# Altium schematic sheet SWITCHING.SchDoc
size 420 x 297 mm; SheetNumber: 6; SheetTotal: 6
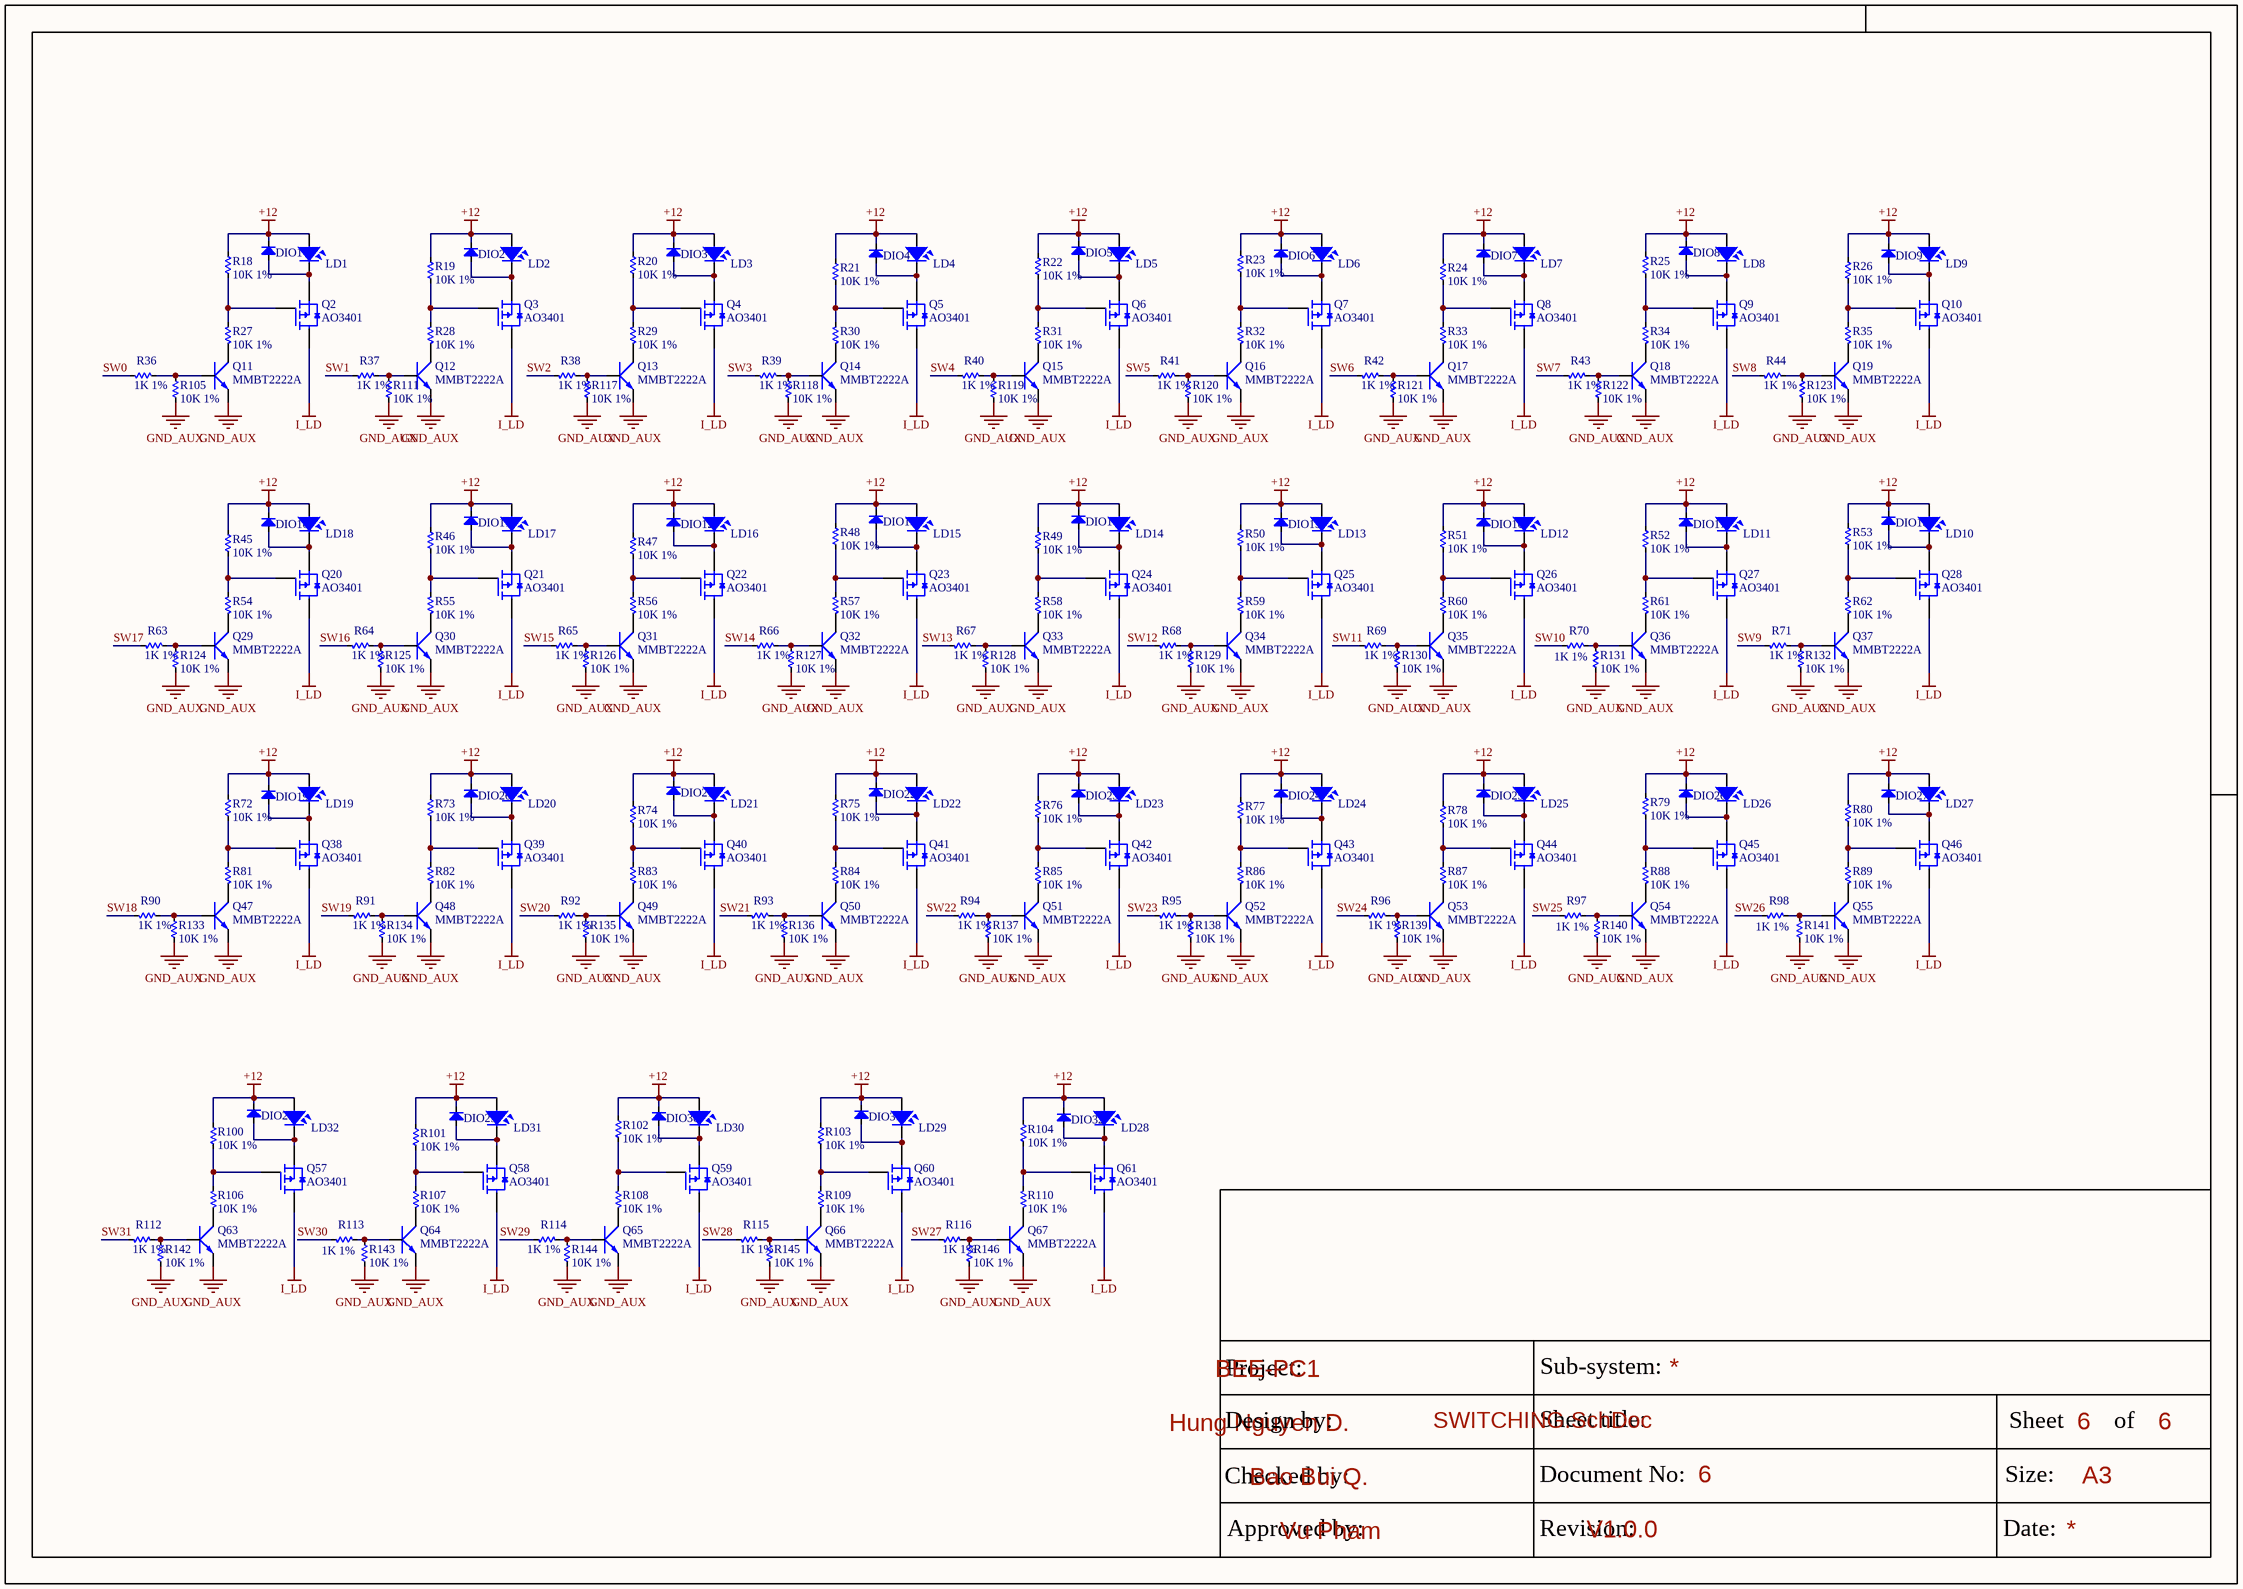
[diagram p0: SWITCHING.SchDoc]

## Parts
DIO1  Diode SMD  [SOD23]  (value not drawn)
DIO2  Diode SMD  [SOD23]  (value not drawn)
DIO3  Diode SMD  [SOD23]  (value not drawn)
DIO4  Diode SMD  [SOD23]  (value not drawn)
DIO5  Diode SMD  [SOD23]  (value not drawn)
DIO6  Diode SMD  [SOD23]  (value not drawn)
DIO7  Diode SMD  [SOD23]  (value not drawn)
DIO8  Diode SMD  [SOD23]  (value not drawn)
DIO9  Diode SMD  [SOD23]  (value not drawn)
DIO10  Diode SMD  [SOD23]  (value not drawn)
DIO11  Diode SMD  [SOD23]  (value not drawn)
DIO12  Diode SMD  [SOD23]  (value not drawn)
DIO13  Diode SMD  [SOD23]  (value not drawn)
DIO14  Diode SMD  [SOD23]  (value not drawn)
DIO15  Diode SMD  [SOD23]  (value not drawn)
DIO16  Diode SMD  [SOD23]  (value not drawn)
DIO17  Diode SMD  [SOD23]  (value not drawn)
DIO18  Diode SMD  [SOD23]  (value not drawn)
DIO19  Diode SMD  [SOD23]  (value not drawn)
DIO20  Diode SMD  [SOD23]  (value not drawn)
DIO21  Diode SMD  [SOD23]  (value not drawn)
DIO22  Diode SMD  [SOD23]  (value not drawn)
DIO23  Diode SMD  [SOD23]  (value not drawn)
DIO24  Diode SMD  [SOD23]  (value not drawn)
DIO25  Diode SMD  [SOD23]  (value not drawn)
DIO26  Diode SMD  [SOD23]  (value not drawn)
DIO27  Diode SMD  [SOD23]  (value not drawn)
DIO28  Diode SMD  [SOD23]  (value not drawn)
DIO29  Diode SMD  [SOD23]  (value not drawn)
DIO30  Diode SMD  [SOD23]  (value not drawn)
DIO31  Diode SMD  [SOD23]  (value not drawn)
DIO32  Diode SMD  [SOD23]  (value not drawn)
LD1  LaserDiode  [LASER]  (value not drawn)
LD2  LaserDiode  [LASER]  (value not drawn)
LD3  LaserDiode  [LASER]  (value not drawn)
LD4  LaserDiode  [LASER]  (value not drawn)
LD5  LaserDiode  [LASER]  (value not drawn)
LD6  LaserDiode  [LASER]  (value not drawn)
LD7  LaserDiode  [LASER]  (value not drawn)
LD8  LaserDiode  [LASER]  (value not drawn)
LD9  LaserDiode  [LASER]  (value not drawn)
LD10  LaserDiode  [LASER]  (value not drawn)
LD11  LaserDiode  [LASER]  (value not drawn)
LD12  LaserDiode  [LASER]  (value not drawn)
LD13  LaserDiode  [LASER]  (value not drawn)
LD14  LaserDiode  [LASER]  (value not drawn)
LD15  LaserDiode  [LASER]  (value not drawn)
LD16  LaserDiode  [LASER]  (value not drawn)
LD17  LaserDiode  [LASER]  (value not drawn)
LD18  LaserDiode  [LASER]  (value not drawn)
LD19  LaserDiode  [LASER]  (value not drawn)
LD20  LaserDiode  [LASER]  (value not drawn)
LD21  LaserDiode  [LASER]  (value not drawn)
LD22  LaserDiode  [LASER]  (value not drawn)
LD23  LaserDiode  [LASER]  (value not drawn)
LD24  LaserDiode  [LASER]  (value not drawn)
LD25  LaserDiode  [LASER]  (value not drawn)
LD26  LaserDiode  [LASER]  (value not drawn)
LD27  LaserDiode  [LASER]  (value not drawn)
LD28  LaserDiode  [LASER]  (value not drawn)
LD29  LaserDiode  [LASER]  (value not drawn)
LD30  LaserDiode  [LASER]  (value not drawn)
LD31  LaserDiode  [LASER]  (value not drawn)
LD32  LaserDiode  [LASER]  (value not drawn)
Q2  AO3401  [SOT23-123]
Q3  AO3401  [SOT23-123]
Q4  AO3401  [SOT23-123]
Q5  AO3401  [SOT23-123]
Q6  AO3401  [SOT23-123]
Q7  AO3401  [SOT23-123]
Q8  AO3401  [SOT23-123]
Q9  AO3401  [SOT23-123]
Q10  AO3401  [SOT23-123]
Q11  MMBT2222A  [SOT23-132]
Q12  MMBT2222A  [SOT23-132]
Q13  MMBT2222A  [SOT23-132]
Q14  MMBT2222A  [SOT23-132]
Q15  MMBT2222A  [SOT23-132]
Q16  MMBT2222A  [SOT23-132]
Q17  MMBT2222A  [SOT23-132]
Q18  MMBT2222A  [SOT23-132]
Q19  MMBT2222A  [SOT23-132]
Q20  AO3401  [SOT23-123]
Q21  AO3401  [SOT23-123]
Q22  AO3401  [SOT23-123]
Q23  AO3401  [SOT23-123]
Q24  AO3401  [SOT23-123]
Q25  AO3401  [SOT23-123]
Q26  AO3401  [SOT23-123]
Q27  AO3401  [SOT23-123]
Q28  AO3401  [SOT23-123]
Q29  MMBT2222A  [SOT23-132]
Q30  MMBT2222A  [SOT23-132]
Q31  MMBT2222A  [SOT23-132]
Q32  MMBT2222A  [SOT23-132]
Q33  MMBT2222A  [SOT23-132]
Q34  MMBT2222A  [SOT23-132]
Q35  MMBT2222A  [SOT23-132]
Q36  MMBT2222A  [SOT23-132]
Q37  MMBT2222A  [SOT23-132]
Q38  AO3401  [SOT23-123]
Q39  AO3401  [SOT23-123]
Q40  AO3401  [SOT23-123]
Q41  AO3401  [SOT23-123]
Q42  AO3401  [SOT23-123]
Q43  AO3401  [SOT23-123]
Q44  AO3401  [SOT23-123]
Q45  AO3401  [SOT23-123]
Q46  AO3401  [SOT23-123]
Q47  MMBT2222A  [SOT23-132]
Q48  MMBT2222A  [SOT23-132]
Q49  MMBT2222A  [SOT23-132]
Q50  MMBT2222A  [SOT23-132]
Q51  MMBT2222A  [SOT23-132]
Q52  MMBT2222A  [SOT23-132]
Q53  MMBT2222A  [SOT23-132]
Q54  MMBT2222A  [SOT23-132]
Q55  MMBT2222A  [SOT23-132]
Q57  AO3401  [SOT23-123]
Q58  AO3401  [SOT23-123]
Q59  AO3401  [SOT23-123]
Q60  AO3401  [SOT23-123]
Q61  AO3401  [SOT23-123]
Q63  MMBT2222A  [SOT23-132]
Q64  MMBT2222A  [SOT23-132]
Q65  MMBT2222A  [SOT23-132]
Q66  MMBT2222A  [SOT23-132]
Q67  MMBT2222A  [SOT23-132]
R18  10K 1%  [RES-SMD-0603]
R19  10K 1%  [RES-SMD-0603]
R20  10K 1%  [RES-SMD-0603]
R21  10K 1%  [RES-SMD-0603]
R22  10K 1%  [RES-SMD-0603]
R23  10K 1%  [RES-SMD-0603]
R24  10K 1%  [RES-SMD-0603]
R25  10K 1%  [RES-SMD-0603]
R26  10K 1%  [RES-SMD-0603]
R27  10K 1%  [RES-SMD-0603]
R28  10K 1%  [RES-SMD-0603]
R29  10K 1%  [RES-SMD-0603]
R30  10K 1%  [RES-SMD-0603]
R31  10K 1%  [RES-SMD-0603]
R32  10K 1%  [RES-SMD-0603]
R33  10K 1%  [RES-SMD-0603]
R34  10K 1%  [RES-SMD-0603]
R35  10K 1%  [RES-SMD-0603]
R36  1K 1%  [RES-SMD-0603]
R37  1K 1%  [RES-SMD-0603]
R38  1K 1%  [RES-SMD-0603]
R39  1K 1%  [RES-SMD-0603]
R40  1K 1%  [RES-SMD-0603]
R41  1K 1%  [RES-SMD-0603]
R42  1K 1%  [RES-SMD-0603]
R43  1K 1%  [RES-SMD-0603]
R44  1K 1%  [RES-SMD-0603]
R45  10K 1%  [RES-SMD-0603]
R46  10K 1%  [RES-SMD-0603]
R47  10K 1%  [RES-SMD-0603]
R48  10K 1%  [RES-SMD-0603]
R49  10K 1%  [RES-SMD-0603]
R50  10K 1%  [RES-SMD-0603]
R51  10K 1%  [RES-SMD-0603]
R52  10K 1%  [RES-SMD-0603]
R53  10K 1%  [RES-SMD-0603]
R54  10K 1%  [RES-SMD-0603]
R55  10K 1%  [RES-SMD-0603]
R56  10K 1%  [RES-SMD-0603]
R57  10K 1%  [RES-SMD-0603]
R58  10K 1%  [RES-SMD-0603]
R59  10K 1%  [RES-SMD-0603]
R60  10K 1%  [RES-SMD-0603]
R61  10K 1%  [RES-SMD-0603]
R62  10K 1%  [RES-SMD-0603]
R63  1K 1%  [RES-SMD-0603]
R64  1K 1%  [RES-SMD-0603]
R65  1K 1%  [RES-SMD-0603]
R66  1K 1%  [RES-SMD-0603]
R67  1K 1%  [RES-SMD-0603]
R68  1K 1%  [RES-SMD-0603]
R69  1K 1%  [RES-SMD-0603]
R70  1K 1%  [RES-SMD-0603]
R71  1K 1%  [RES-SMD-0603]
R72  10K 1%  [RES-SMD-0603]
R73  10K 1%  [RES-SMD-0603]
R74  10K 1%  [RES-SMD-0603]
R75  10K 1%  [RES-SMD-0603]
R76  10K 1%  [RES-SMD-0603]
R77  10K 1%  [RES-SMD-0603]
R78  10K 1%  [RES-SMD-0603]
R79  10K 1%  [RES-SMD-0603]
R80  10K 1%  [RES-SMD-0603]
R81  10K 1%  [RES-SMD-0603]
R82  10K 1%  [RES-SMD-0603]
R83  10K 1%  [RES-SMD-0603]
R84  10K 1%  [RES-SMD-0603]
R85  10K 1%  [RES-SMD-0603]
R86  10K 1%  [RES-SMD-0603]
R87  10K 1%  [RES-SMD-0603]
R88  10K 1%  [RES-SMD-0603]
R89  10K 1%  [RES-SMD-0603]
R90  1K 1%  [RES-SMD-0603]
R91  1K 1%  [RES-SMD-0603]
R92  1K 1%  [RES-SMD-0603]
R93  1K 1%  [RES-SMD-0603]
R94  1K 1%  [RES-SMD-0603]
R95  1K 1%  [RES-SMD-0603]
R96  1K 1%  [RES-SMD-0603]
R97  1K 1%  [RES-SMD-0603]
R98  1K 1%  [RES-SMD-0603]
R100  10K 1%  [RES-SMD-0603]
R101  10K 1%  [RES-SMD-0603]
R102  10K 1%  [RES-SMD-0603]
R103  10K 1%  [RES-SMD-0603]
R104  10K 1%  [RES-SMD-0603]
R105  10K 1%  [RES-SMD-0603]
R106  10K 1%  [RES-SMD-0603]
R107  10K 1%  [RES-SMD-0603]
R108  10K 1%  [RES-SMD-0603]
R109  10K 1%  [RES-SMD-0603]
R110  10K 1%  [RES-SMD-0603]
R111  10K 1%  [RES-SMD-0603]
R112  1K 1%  [RES-SMD-0603]
R113  1K 1%  [RES-SMD-0603]
R114  1K 1%  [RES-SMD-0603]
R115  1K 1%  [RES-SMD-0603]
R116  1K 1%  [RES-SMD-0603]
R117  10K 1%  [RES-SMD-0603]
R118  10K 1%  [RES-SMD-0603]
R119  10K 1%  [RES-SMD-0603]
R120  10K 1%  [RES-SMD-0603]
R121  10K 1%  [RES-SMD-0603]
R122  10K 1%  [RES-SMD-0603]
R123  10K 1%  [RES-SMD-0603]
R124  10K 1%  [RES-SMD-0603]
R125  10K 1%  [RES-SMD-0603]
R126  10K 1%  [RES-SMD-0603]
R127  10K 1%  [RES-SMD-0603]
R128  10K 1%  [RES-SMD-0603]
R129  10K 1%  [RES-SMD-0603]
R130  10K 1%  [RES-SMD-0603]
R131  10K 1%  [RES-SMD-0603]
R132  10K 1%  [RES-SMD-0603]
R133  10K 1%  [RES-SMD-0603]
R134  10K 1%  [RES-SMD-0603]
R135  10K 1%  [RES-SMD-0603]
R136  10K 1%  [RES-SMD-0603]
R137  10K 1%  [RES-SMD-0603]
R138  10K 1%  [RES-SMD-0603]
R139  10K 1%  [RES-SMD-0603]
R140  10K 1%  [RES-SMD-0603]
R141  10K 1%  [RES-SMD-0603]
R142  10K 1%  [RES-SMD-0603]
R143  10K 1%  [RES-SMD-0603]
R144  10K 1%  [RES-SMD-0603]
R145  10K 1%  [RES-SMD-0603]
R146  10K 1%  [RES-SMD-0603]

## Nets
+12: DIO1.2(K) DIO2.2(K) DIO3.2(K) DIO4.2(K) DIO5.2(K) DIO6.2(K) DIO7.2(K) DIO8.2(K) DIO9.2(K) DIO10.2(K) DIO11.2(K) DIO12.2(K) DIO13.2(K) DIO14.2(K) DIO15.2(K) DIO16.2(K) DIO17.2(K) DIO18.2(K) DIO19.2(K) DIO20.2(K) DIO21.2(K) DIO22.2(K) DIO23.2(K) DIO24.2(K) DIO25.2(K) DIO26.2(K) DIO27.2(K) DIO28.2(K) DIO29.2(K) DIO30.2(K) DIO31.2(K) DIO32.2(K) LD1.1 LD2.1 LD3.1 LD4.1 LD5.1 LD6.1 LD7.1 LD8.1 LD9.1 LD10.1 LD11.1 LD12.1 LD13.1 LD14.1 LD15.1 LD16.1 LD17.1 LD18.1 LD19.1 LD20.1 LD21.1 LD22.1 LD23.1 LD24.1 LD25.1 LD26.1 LD27.1 LD28.1 LD29.1 LD30.1 LD31.1 LD32.1 R18.1 R19.1 R20.1 R21.1 R22.1 R23.1 R24.1 R25.1 R26.1 R45.1 R46.1 R47.1 R48.1 R49.1 R50.1 R51.1 R52.1 R53.1 R72.1 R73.1 R74.1 R75.1 R76.1 R77.1 R78.1 R79.1 R80.1 R100.1 R101.1 R102.1 R103.1 R104.1
GND_AUX: Q11.2(E) Q12.2(E) Q13.2(E) Q14.2(E) Q15.2(E) Q16.2(E) Q17.2(E) Q18.2(E) Q19.2(E) Q29.2(E) Q30.2(E) Q31.2(E) Q32.2(E) Q33.2(E) Q34.2(E) Q35.2(E) Q36.2(E) Q37.2(E) Q47.2(E) Q48.2(E) Q49.2(E) Q50.2(E) Q51.2(E) Q52.2(E) Q53.2(E) Q54.2(E) Q55.2(E) Q63.2(E) Q64.2(E) Q65.2(E) Q66.2(E) Q67.2(E) R105.2 R111.2 R117.2 R118.2 R119.2 R120.2 R121.2 R122.2 R123.2 R124.2 R125.2 R126.2 R127.2 R128.2 R129.2 R130.2 R131.2 R132.2 R133.2 R134.2 R135.2 R136.2 R137.2 R138.2 R139.2 R140.2 R141.2 R142.2 R143.2 R144.2 R145.2 R146.2
I_LD: Q2.2 Q3.2 Q4.2 Q5.2 Q6.2 Q7.2 Q8.2 Q9.2 Q10.2 Q20.2 Q21.2 Q22.2 Q23.2 Q24.2 Q25.2 Q26.2 Q27.2 Q28.2 Q38.2 Q39.2 Q40.2 Q41.2 Q42.2 Q43.2 Q44.2 Q45.2 Q46.2 Q57.2 Q58.2 Q59.2 Q60.2 Q61.2
SW0: R36.1
SW1: R37.1
SW2: R38.1
SW3: R39.1
SW4: R40.1
SW5: R41.1
SW6: R42.1
SW7: R43.1
SW8: R44.1
SW9: R71.1
SW10: R70.1
SW11: R69.1
SW12: R68.1
SW13: R67.1
SW14: R66.1
SW15: R65.1
SW16: R64.1
SW17: R63.1
SW18: R90.1
SW19: R91.1
SW20: R92.1
SW21: R93.1
SW22: R94.1
SW23: R95.1
SW24: R96.1
SW25: R97.1
SW26: R98.1
SW27: R116.1
SW28: R115.1
SW29: R114.1
SW30: R113.1
SW31: R112.1
NetDIO1_1: DIO1.1(A) LD1.3 Q2.3
NetDIO2_1: DIO2.1(A) LD2.3 Q3.3
NetDIO3_1: DIO3.1(A) LD3.3 Q4.3
NetDIO4_1: DIO4.1(A) LD4.3 Q5.3
NetDIO5_1: DIO5.1(A) LD5.3 Q6.3
NetDIO6_1: DIO6.1(A) LD6.3 Q7.3
NetDIO7_1: DIO7.1(A) LD7.3 Q8.3
NetDIO8_1: DIO8.1(A) LD8.3 Q9.3
NetDIO9_1: DIO9.1(A) LD9.3 Q10.3
NetDIO10_1: DIO10.1(A) LD18.3 Q20.3
NetDIO11_1: DIO11.1(A) LD17.3 Q21.3
NetDIO12_1: DIO12.1(A) LD16.3 Q22.3
NetDIO13_1: DIO13.1(A) LD15.3 Q23.3
NetDIO14_1: DIO14.1(A) LD14.3 Q24.3
NetDIO15_1: DIO15.1(A) LD13.3 Q25.3
NetDIO16_1: DIO16.1(A) LD12.3 Q26.3
NetDIO17_1: DIO17.1(A) LD11.3 Q27.3
NetDIO18_1: DIO18.1(A) LD10.3 Q28.3
NetDIO19_1: DIO19.1(A) LD19.3 Q38.3
NetDIO20_1: DIO20.1(A) LD20.3 Q39.3
NetDIO21_1: DIO21.1(A) LD21.3 Q40.3
NetDIO22_1: DIO22.1(A) LD22.3 Q41.3
NetDIO23_1: DIO23.1(A) LD23.3 Q42.3
NetDIO24_1: DIO24.1(A) LD24.3 Q43.3
NetDIO25_1: DIO25.1(A) LD25.3 Q44.3
NetDIO26_1: DIO26.1(A) LD26.3 Q45.3
NetDIO27_1: DIO27.1(A) LD27.3 Q46.3
NetDIO28_1: DIO28.1(A) LD32.3 Q57.3
NetDIO29_1: DIO29.1(A) LD31.3 Q58.3
NetDIO30_1: DIO30.1(A) LD30.3 Q59.3
NetDIO31_1: DIO31.1(A) LD29.3 Q60.3
NetDIO32_1: DIO32.1(A) LD28.3 Q61.3
NetQ2_1: Q2.1 R18.2 R27.2
NetQ3_1: Q3.1 R19.2 R28.2
NetQ4_1: Q4.1 R20.2 R29.2
NetQ5_1: Q5.1 R21.2 R30.2
NetQ6_1: Q6.1 R22.2 R31.2
NetQ7_1: Q7.1 R23.2 R32.2
NetQ8_1: Q8.1 R24.2 R33.2
NetQ9_1: Q9.1 R25.2 R34.2
NetQ10_1: Q10.1 R26.2 R35.2
NetQ11_1: Q11.1(B) R36.2 R105.1
NetQ11_3: Q11.3(C) R27.1
NetQ12_1: Q12.1(B) R37.2 R111.1
NetQ12_3: Q12.3(C) R28.1
NetQ13_1: Q13.1(B) R38.2 R117.1
NetQ13_3: Q13.3(C) R29.1
NetQ14_1: Q14.1(B) R39.2 R118.1
NetQ14_3: Q14.3(C) R30.1
NetQ15_1: Q15.1(B) R40.2 R119.1
NetQ15_3: Q15.3(C) R31.1
NetQ16_1: Q16.1(B) R41.2 R120.1
NetQ16_3: Q16.3(C) R32.1
NetQ17_1: Q17.1(B) R42.2 R121.1
NetQ17_3: Q17.3(C) R33.1
NetQ18_1: Q18.1(B) R43.2 R122.1
NetQ18_3: Q18.3(C) R34.1
NetQ19_1: Q19.1(B) R44.2 R123.1
NetQ19_3: Q19.3(C) R35.1
NetQ20_1: Q20.1 R45.2 R54.2
NetQ21_1: Q21.1 R46.2 R55.2
NetQ22_1: Q22.1 R47.2 R56.2
NetQ23_1: Q23.1 R48.2 R57.2
NetQ24_1: Q24.1 R49.2 R58.2
NetQ25_1: Q25.1 R50.2 R59.2
NetQ26_1: Q26.1 R51.2 R60.2
NetQ27_1: Q27.1 R52.2 R61.2
NetQ28_1: Q28.1 R53.2 R62.2
NetQ29_1: Q29.1(B) R63.2 R124.1
NetQ29_3: Q29.3(C) R54.1
NetQ30_1: Q30.1(B) R64.2 R125.1
NetQ30_3: Q30.3(C) R55.1
NetQ31_1: Q31.1(B) R65.2 R126.1
NetQ31_3: Q31.3(C) R56.1
NetQ32_1: Q32.1(B) R66.2 R127.1
NetQ32_3: Q32.3(C) R57.1
NetQ33_1: Q33.1(B) R67.2 R128.1
NetQ33_3: Q33.3(C) R58.1
NetQ34_1: Q34.1(B) R68.2 R129.1
NetQ34_3: Q34.3(C) R59.1
NetQ35_1: Q35.1(B) R69.2 R130.1
NetQ35_3: Q35.3(C) R60.1
NetQ36_1: Q36.1(B) R70.2 R131.1
NetQ36_3: Q36.3(C) R61.1
NetQ37_1: Q37.1(B) R71.2 R132.1
NetQ37_3: Q37.3(C) R62.1
NetQ38_1: Q38.1 R72.2 R81.2
NetQ39_1: Q39.1 R73.2 R82.2
NetQ40_1: Q40.1 R74.2 R83.2
NetQ41_1: Q41.1 R75.2 R84.2
NetQ42_1: Q42.1 R76.2 R85.2
NetQ43_1: Q43.1 R77.2 R86.2
NetQ44_1: Q44.1 R78.2 R87.2
NetQ45_1: Q45.1 R79.2 R88.2
NetQ46_1: Q46.1 R80.2 R89.2
NetQ47_1: Q47.1(B) R90.2 R133.1
NetQ47_3: Q47.3(C) R81.1
NetQ48_1: Q48.1(B) R91.2 R134.1
NetQ48_3: Q48.3(C) R82.1
NetQ49_1: Q49.1(B) R92.2 R135.1
NetQ49_3: Q49.3(C) R83.1
NetQ50_1: Q50.1(B) R93.2 R136.1
NetQ50_3: Q50.3(C) R84.1
NetQ51_1: Q51.1(B) R94.2 R137.1
NetQ51_3: Q51.3(C) R85.1
NetQ52_1: Q52.1(B) R95.2 R138.1
NetQ52_3: Q52.3(C) R86.1
NetQ53_1: Q53.1(B) R96.2 R139.1
NetQ53_3: Q53.3(C) R87.1
NetQ54_1: Q54.1(B) R97.2 R140.1
NetQ54_3: Q54.3(C) R88.1
NetQ55_1: Q55.1(B) R98.2 R141.1
NetQ55_3: Q55.3(C) R89.1
NetQ57_1: Q57.1 R100.2 R106.2
NetQ58_1: Q58.1 R101.2 R107.2
NetQ59_1: Q59.1 R102.2 R108.2
NetQ60_1: Q60.1 R103.2 R109.2
NetQ61_1: Q61.1 R104.2 R110.2
NetQ63_1: Q63.1(B) R112.2 R142.1
NetQ63_3: Q63.3(C) R106.1
NetQ64_1: Q64.1(B) R113.2 R143.1
NetQ64_3: Q64.3(C) R107.1
NetQ65_1: Q65.1(B) R114.2 R144.1
NetQ65_3: Q65.3(C) R108.1
NetQ66_1: Q66.1(B) R115.2 R145.1
NetQ66_3: Q66.3(C) R109.1
NetQ67_1: Q67.1(B) R116.2 R146.1
NetQ67_3: Q67.3(C) R110.1

## Notes on the sheet
- Project:
- BEE-PC1
- Sub-system:
- Design by:
- Hung Nguyen D.
- Bao Bui Q.
- Sheet title:
- Sheet
- A3
- of
- Checked by:
- Approved by:
- Vu Pham
- Revision:
- Document No:
- V1.0.0
- Size:
- Date:

## Library data of the parts
DIO1-DIO32 = Diode SMD: Default Diode; Code - JEDEC: DO-214-AB; Value: 1N5007; Published: 8-Jun-2000; Revision: July-2002: Re-released for DXP Platform.; Publisher: Altium Limited
LD1-LD32 = LD
Q2-Q10 Q20-Q28 Q38-Q46 Q57-Q61 = FET-P
Q11-Q19 Q29-Q37 Q47-Q55 Q63-Q67 = 2SC1815: SOT23-3; Value: C1815
R18-R98 R100-R146 = Res-SMD: 0603; Manufacturer: Generic Components; Class: Passive; Published: 08/06/2000; Publisher: Altium Hobart Technology Centre